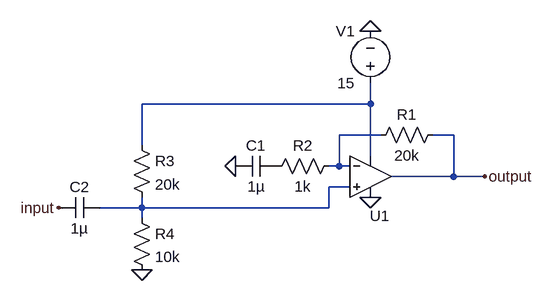
[diagram p0: schematic ampli_shcematic.asc]
ampli_shcematic.asc, the LTspice schematic file:
Version 4
SHEET 1 880 680
WIRE -32 -32 -32 -64
WIRE -32 -32 -384 -32
WIRE -16 16 -80 16
WIRE 96 16 64 16
WIRE -384 32 -384 -32
WIRE -32 48 -32 -32
WIRE -80 64 -80 16
WIRE -80 64 -96 64
WIRE -64 64 -80 64
WIRE 96 80 96 16
WIRE 96 80 0 80
WIRE 144 80 96 80
WIRE -64 96 -96 96
WIRE -384 128 -384 112
WIRE -384 128 -448 128
WIRE -96 128 -96 96
WIRE -96 128 -384 128
WIRE -384 144 -384 128
FLAG -32 -144 0
FLAG -32 112 0
FLAG -384 224 0
FLAG 144 80 output
FLAG -240 64 0
FLAG -512 128 input
SYMBOL OpAmps\\UniversalOpAmp2 -32 80 R0
WINDOW 0 -1 61 Left 2
SYMATTR InstName U1
SYMBOL res 80 0 R90
WINDOW 0 0 56 VBottom 2
WINDOW 3 32 56 VTop 2
SYMATTR InstName R1
SYMATTR Value 20k
SYMBOL res -80 48 R90
WINDOW 0 0 56 VBottom 2
WINDOW 3 32 56 VTop 2
SYMATTR InstName R2
SYMATTR Value 1k
SYMBOL res -400 16 R0
SYMATTR InstName R3
SYMATTR Value 20k
SYMBOL res -400 128 R0
SYMATTR InstName R4
SYMATTR Value 10k
SYMBOL voltage -32 -48 R180
WINDOW 0 24 96 Left 2
WINDOW 3 24 16 Left 2
SYMATTR InstName V1
SYMATTR Value 15
SYMBOL cap -176 48 R90
WINDOW 0 0 32 VBottom 2
WINDOW 3 32 32 VTop 2
SYMATTR InstName C1
SYMATTR Value 1µ
SYMBOL cap -448 112 R90
WINDOW 0 0 32 VBottom 2
WINDOW 3 32 32 VTop 2
SYMATTR InstName C2
SYMATTR Value 1µ

The netlist it stands for:
* ampli_shcematic.asc
XU1 N003 N002 N001 0 output level2 Avol=1Meg GBW=10Meg Slew=10Meg Ilimit=25m Rail=0 Vos=0 En=0 Enk=0 In=0 Ink=0 Rin=500Meg  ; pins In+ In- V+ V- OUT
R1 output N002 20k
R2 N002 P001 1k
R3 N001 N003 20k
R4 N003 0 10k
V1 N001 0 15
C1 P001 0 1µ
C2 N003 input 1µ
.lib UniversalOpAmp2.lib
.backanno
.end